# EAGLE design Gravador_ISP (EAGLE 9.5.2)
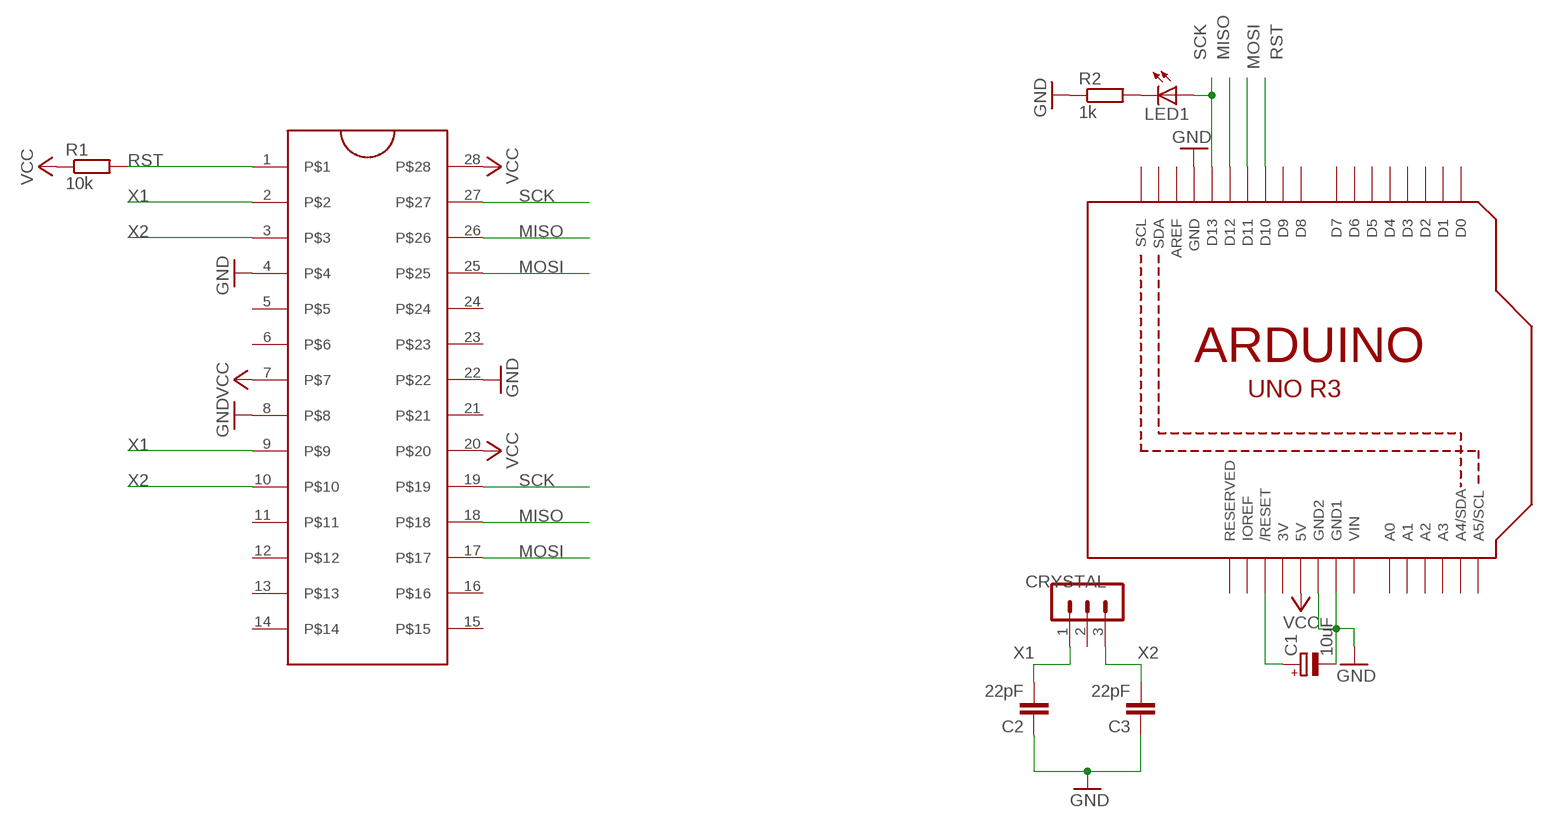
[diagram p0: schematic, sheet 1]

## Parts
C1  10uF  CPOL-EUE2.5-5  [E2,5-5]
C2  22pF  C-EU050-024X044  [C050-024X044]
C3  22pF  C-EU050-024X044  [C050-024X044]
CRYSTAL  MA03-1  [MA03-1]
J1  ZIFSOCKET-28-3"  [DIL28-3-ZIF_SOCKET]
LED1  LED3MM  [LED3MM]
R1  10k  R-EU_0207/10  [0207/10]
R2  1k  R-EU_0207/10  [0207/10]
U1  ARDUINOR3-DIMENSION  [ARDUINOR3]

## Nets
GND: C1.- C2.1 C3.1 J1.4 J1.8 J1.22 R2.1 U1.GND U1.GND1 U1.GND2
MISO: J1.18 J1.26 U1.D12
MOSI: J1.17 J1.25 U1.D11
N$1: LED1.K(C) R2.2
N$3: C1.+ U1.RESET(/RESET)
RST: J1.1 R1.2 U1.D10
SCK: J1.19 J1.27 LED1.A U1.D13
VCC: J1.7 J1.20 J1.28 R1.1 U1.5V
X1: C2.2 CRYSTAL.1 J1.2 J1.9
X2: C3.2 CRYSTAL.3 J1.3 J1.10
Unconnected: CRYSTAL.2 J1.5 J1.6 J1.11 J1.12 J1.13 J1.14 J1.15 J1.16 J1.21 J1.23 J1.24 U1.A0 U1.A1 U1.A2 U1.A3 U1.A4(A4/SDA) U1.A5(A5/SCL) U1.AREF U1.D0 U1.D1 U1.D2 U1.D3 U1.D4 U1.D5 U1.D6 U1.D7 U1.D8 U1.D9 U1.IOREF U1.RESERVED U1.SCL U1.SDA

## Power pins joined to a net without a drawn wire
3V: U1.3V
VIN: U1.VIN

## Library data of the parts
C1 = rcl:CPOL-EU: POLARIZED CAPACITOR, European symbol; SPICEPREFIX: C
C2 C3 = rcl:C-EU: CAPACITOR, European symbol; SPICEPREFIX: C
CRYSTAL = con-lstb:MA03-1: PIN HEADER; OC_FARNELL: unknown; OC_NEWARK: unknown
J1 = SparkFun-Connectors:ZIFSOCKET-28-3: ZIF Socket 28-Pin 0.3" Lever-action ZIF socket for 28-pin ICs SparkFun Products: ZIF Socket 28-Pin <https://www.sparkfun.com/products/9175>; PROD_ID: CONN-10960; SF_ID: PRT-09175
LED1 = adafruit:LED: LED OSRAM: - CHIPLED LG R971, LG N971, LY N971, LG Q971, LY Q971, LO R971, LY R971 LH N974, LH R974 LS Q976, LO Q976, LY Q976 LO Q996 - Hyper CHIPLED LW Q18S LB Q993, LB Q99A, LB R99A - SideLED LS A670, LO A670, LY A670, LG A670, LP A670 LB A673, LV A673, LT A673, LW A673 LH A674 LY A675 LS A676, LA A676, LO A676, LY A676, LW A676 LS A679, LY A679, LG A679 - Hyper Micro SIDELED® LS Y876, LA Y876, LO Y876, LY Y876 LT Y87S - SmartLED LW L88C, LW L88S LB L89C, LB L89S, LG L890 LS L89K, LO L89K, LY L89K LS L896, LA L896, LO L896, LY L896 - TOPLED LS T670, LO T670, LY T670, LG T670, LP T670 LSG T670, LSP T670, LSY T670, LOP T670, LYG T670 LG T671, LOG T671, LSG T671 LB T673, LV T673, LT T673, LW T673 LH T674 LS T676, LA T676, LO T676, LY T676, LB T676, LH T676, LSB T676, LW T676 LB T67C, LV T67C, LT T67C, LS T67K, LO T67K, LY T67K, LW E67C LS E67B, LA E67B, LO E67B, LY E67B, LB E67C, LV E67C, LT E67C LW T67C LS T679, LY T679, LG T679 LS T770, LO T770, LY T770, LG T770, LP T770 LB T773, LV T773, LT T773, LW T773 LH T774 LS E675, LA E675, LY E675, LS T675 LS T776, LA T776, LO T776, LY T776, LB T776 LHGB T686 LT T68C, LB T68C - Hyper Mini TOPLED® LB M676 - Mini TOPLED Santana® LG M470 LS M47K, LO M47K, LY M47K Source: http://www.osram.convergy.de/
R1 R2 = resistor:R-EU_: RESISTOR, European symbol
U1 = adafruit:ARDUINOR3: This is a new object for the new Arduino R3 - with extra pins that you may want to use (such as IOref, and duplicated A4/A5

## Net classes
0 default: width 0.5 mm, drill 0.9 mm, clearance 0.5 mm

## Board
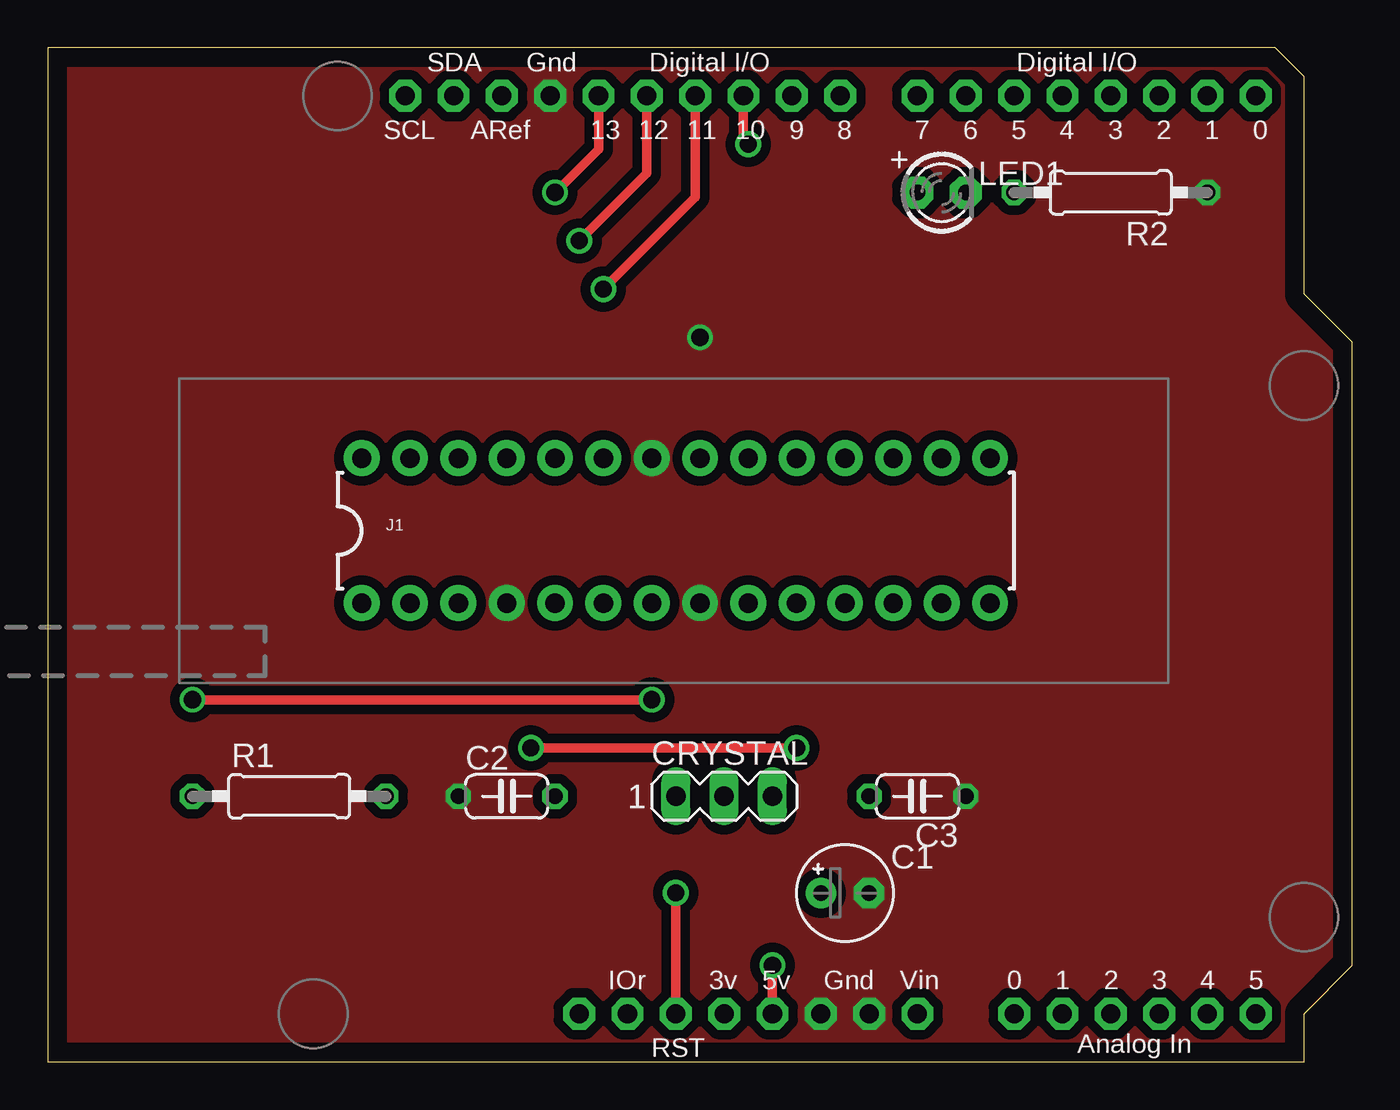
[diagram p1: board, top side]
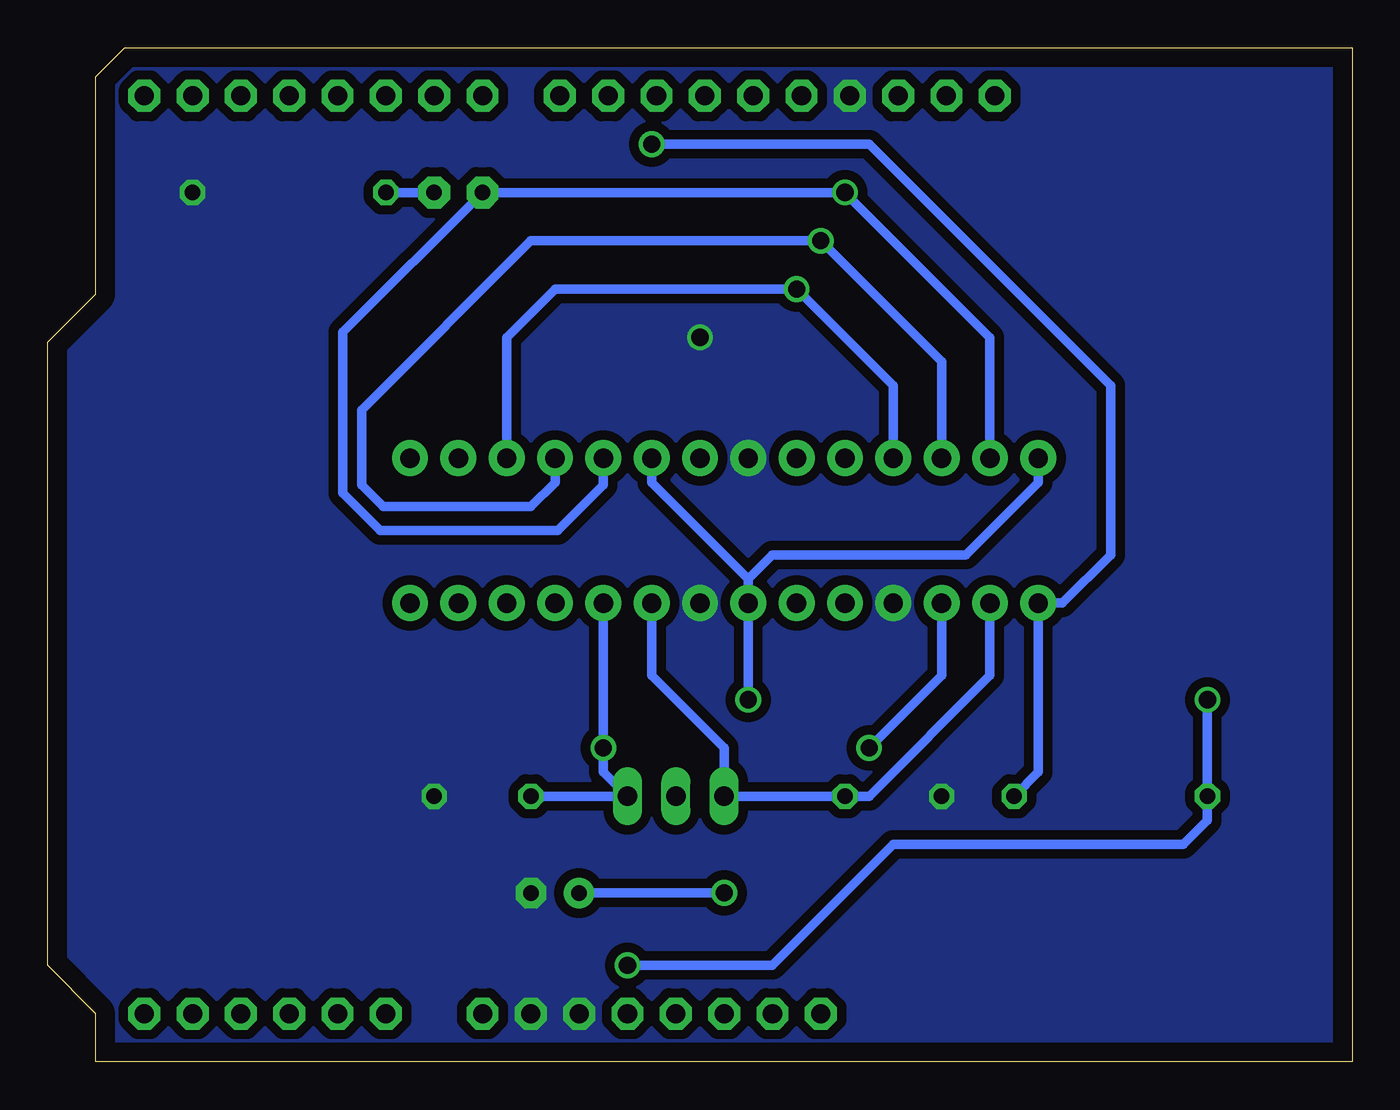
[diagram p2: board, bottom side, seen from below]

Size 68.58 x 53.34 mm. Coordinates in mm from the lower left corner, seen from the top.
Copper layers (1*16): Top 0.035mm / dielectric 1.5mm / Bottom 0.035mm
Design rules "default *": minimum track width 6mil, minimum drill 0.35mm, track to track 6mil, track to pad 6mil, pad to pad 6mil, via to via 6mil, smd to smd 6mil, copper to edge 40mil, drill to drill 6mil, minimum pad ring 10mil, minimum via ring 8mil, stop-mask expansion 4mil, vias tented up to drill 0mil, thermal gap 0mil

### Footprints (pad centres in the part's own frame; a part is rotated, then mirrored left to right if it is on the bottom)
E2,5-5 = drill 0.813 pad 1.6: + -1.27,0 | drill 0.813 pad 1.6 octagon: - 1.27,0
C050-024X044 = drill 0.813 octagon: 1 -2.54,0; 2 2.54,0
MA03-1 = drill 1.016 long: 1 -2.54,0; 2 0,0; 3 2.54,0
DIL28-3-ZIF_SOCKET = drill 1.016 pad 1.88: 1 -16.51,-3.81; 2 -13.97,-3.81; 3 -11.43,-3.81; 4 -8.89,-3.81; 5 -6.35,-3.81; 6 -3.81,-3.81; 7 -1.27,-3.81; 8 1.27,-3.81; 9 3.81,-3.81; 10 6.35,-3.81; 11 8.89,-3.81; 12 11.43,-3.81; 13 13.97,-3.81; 14 16.51,-3.81; 15 16.51,3.81; 16 13.97,3.81; 17 11.43,3.81; 18 8.89,3.81; 19 6.35,3.81; 20 3.81,3.81; 21 1.27,3.81; 22 -1.27,3.81; 23 -3.81,3.81; 24 -6.35,3.81; 25 -8.89,3.81; 26 -11.43,3.81; 27 -13.97,3.81; 28 -16.51,3.81
LED3MM = drill 0.813 pad 1.676 octagon: A -1.27,0; K 1.27,0
0207/10 = drill 0.813 octagon: 1 -5.08,0; 2 5.08,0
ARDUINOR3 = drill 1 pad 1.676 octagon: 3V 35.56,2.54; 5V 38.1,2.54; A0 50.8,2.54; A1 53.34,2.54; A2 55.88,2.54; A3 58.42,2.54; A4 60.96,2.54; A5 63.5,2.54; AREF 23.876,50.8; D0 63.5,50.8; D1 60.96,50.8; D2 58.42,50.8; D3 55.88,50.8; D4 53.34,50.8; D5 50.8,50.8; D6 48.26,50.8; D7 45.72,50.8; D8 41.656,50.8; D9 39.116,50.8; D10 36.576,50.8; D11 34.036,50.8; D12 31.496,50.8; D13 28.956,50.8; GND 26.416,50.8; GND1 43.18,2.54; GND2 40.64,2.54; IOREF 30.48,2.54; RESERVED 27.94,2.54; RESET 33.02,2.54; SCL 18.796,50.8; SDA 21.336,50.8; VIN 45.72,2.54

### Placement (x,y rotation side)
C1  41.91,8.89 0 top
C2  24.13,13.97 0 top
C3  45.72,13.97 180 top
CRYSTAL  35.56,13.97 0 top
J1  33.02,27.94 0 top
LED1  46.99,45.72 0 top
R1  12.7,13.97 0 top
R2  55.88,45.72 180 top
U1  0,0 0 top

### Tracks (layer width: path | path; a pad name or v marks a point on that pad's centre or on a via)
GND  (via drill 0.9)
  other vias: 34.29,38.1
  pour Top: -2.54,60.96 78.74,60.96 78.74,-8.89 -2.54,-8.89
  pour Bottom: -5.08,66.04 85.09,66.04 85.09,-12.7 -5.08,-12.7
MISO  (via drill 0.9)
  Top 0.5: U1.D12 31.5,46.74 v27.94,43.18
  Bottom 0.5: J1.26 21.59,36.83 v27.94,43.18 43.18,43.18 52.07,34.29 52.07,30.34 50.94,29.21 43.18,29.21 41.91,30.48 J1.18
MOSI  (via drill 0.9)
  Top 0.5: U1.D11 34.04,45.47 v29.21,40.64
  Bottom 0.5: J1.25 24.13,35.56 v29.21,40.64 41.91,40.64 44.45,38.1 J1.17
N$1
  Bottom 0.5: LED1.K R2.2
N$3  (via drill 0.9)
  Top 0.5: U1.RESET v33.02,8.89
  Bottom 0.5: C1.+ v33.02,8.89
RST  (via drill 0.9)
  Top 0.5: v36.83,48.26 36.58,48.51 U1.D10
  Bottom 0.5: R1.2 16.51,15.24 J1.1 15.24,24.13 12.7,26.67 12.7,35.56 25.4,48.26 v36.83,48.26
SCK  (via drill 0.9)
  Top 0.5: U1.D13 28.96,48.01 v26.67,45.72
  Bottom 0.5: J1.27 19.05,38.1 v26.67,45.72 LED1.A 53.07,38.37 53.07,29.92 51.09,27.94 41.77,27.94 39.37,30.34 J1.19
VCC  (via drill 0.9)
  Top 0.5: U1.5V v38.1,5.08 | v7.62,19.05 v31.75,19.05
  Bottom 0.5: J1.28 16.51,30.48 20.32,26.67 30.48,26.67 31.75,25.4 | 31.75,25.4 J1.7 v31.75,19.05 | J1.20 36.83,30.48 31.75,25.4 | v38.1,5.08 30.48,5.08 24.13,11.43 8.89,11.43 7.62,12.7 R1.1 v7.62,19.05
X1
  Bottom 0.5: J1.9 36.83,20.32 33.02,16.51 CRYSTAL.1 C2.2 25.4,13.97 19.05,20.32 J1.2
X2  (via drill 0.9)
  Top 0.5: v39.37,16.51 v25.4,16.51
  Bottom 0.5: C3.2 CRYSTAL.3 39.37,15.24 v39.37,16.51 J1.10 | v25.4,16.51 21.59,20.32 J1.3